# EAGLE design esp32-thing (EAGLE 7.6.0)
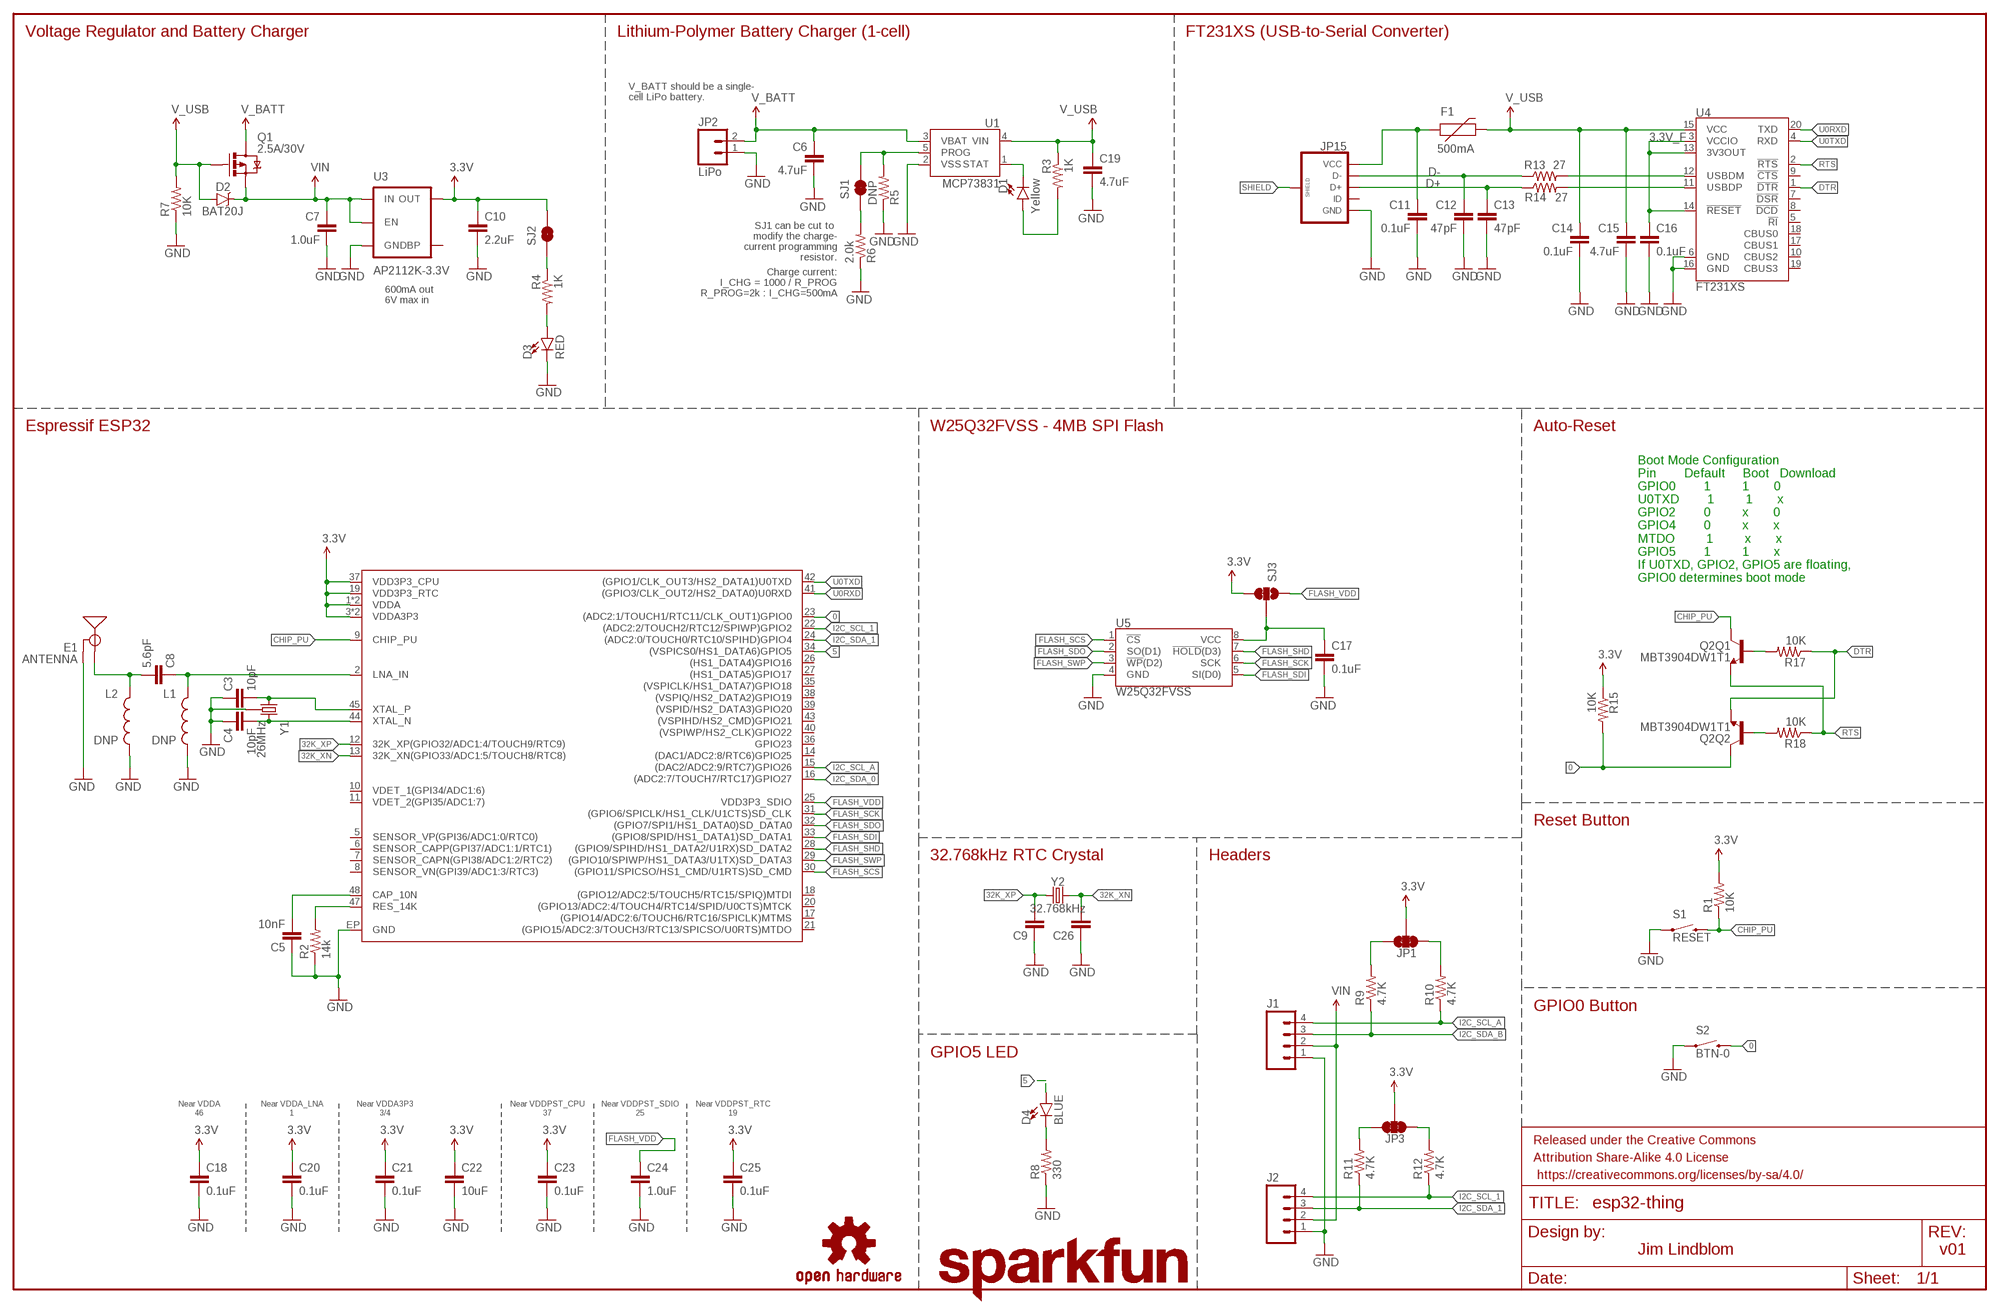
[diagram p0: schematic, sheet 1]

## Parts
C3  10pF  10PF-50V-5%(0603)  [0603-CAP]
C4  10pF  10PF-50V-5%(0603)  [0603-CAP]
C5  10nF  10NF/10000PF-50V-10%(0603)  [0603-CAP]
C6  4.7uF  4.7UF-6.3V-10%(0603)0603  [0603-CAP]
C7  1.0uF  1.0UF-25V-+80/-20(0805)"  [0805-CAP]
C8  5.6pF  CAP0603-CAP  [0603-CAP]
C9  CAP0603-CAP  [0603-CAP]
C10  2.2uF  2.2UF-10V-20%(0603)  [0603-CAP]
C11  0.1uF  0.1UF-25V(+80/-20%)(0603)  [0603-CAP]
C12  47pF  47PF-50V-5%(0603)  [0603-CAP]
C13  47pF  47PF-50V-5%(0603)  [0603-CAP]
C14  0.1uF  0.1UF-25V(+80/-20%)(0603)  [0603-CAP]
C15  4.7uF  4.7UF-6.3V-10%(0603)0603  [0603-CAP]
C16  0.1uF  0.1UF-25V(+80/-20%)(0603)  [0603-CAP]
C17  0.1uF  0.1UF-25V(+80/-20%)(0603)  [0603-CAP]
C18  0.1uF  0.1UF-25V(+80/-20%)(0603)  [0603-CAP]
C19  4.7uF  4.7UF-6.3V-10%(0603)0603  [0603-CAP]
C20  0.1uF  0.1UF-25V(+80/-20%)(0603)  [0603-CAP]
C21  0.1uF  0.1UF-25V(+80/-20%)(0603)  [0603-CAP]
C22  10uF  10UF-6.3V-20%(0603)  [0603-CAP]
C23  0.1uF  0.1UF-25V(+80/-20%)(0603)  [0603-CAP]
C24  1.0uF  1.0UF-16V-10%(0603)  [0603-CAP]
C25  0.1uF  0.1UF-25V(+80/-20%)(0603)  [0603-CAP]
C26  CAP0603-CAP  [0603-CAP]
D1  Yellow  LED-YELLOW0603  [LED-0603]
D2  BAT20J  DIODE-SCHOTTKY-BAT20J  [SOD-323]
D3  RED  LED-RED0603  [LED-0603]
D4  BLUE  LED-BLUE0603  [LED-0603]
E1  ANTENNA  ANTENNATRACE-TUNED  [TRACE_ANTENNA_2.4GHZ_25.7MM_TUNED]
F1  500mA  PTCSMD  [PTC-1206]
FRAME1  FRAME-LEDGER  [CREATIVE_COMMONS]
J1  M04POLAR_LOCK  [MOLEX-1X4_LOCK]
J2  M04POLAR_LOCK  [MOLEX-1X4_LOCK]
JP1  JUMPER-PAD-3-NC_BY_TRACE  [PAD-JUMPER-3-3OF3_NC_BY_TRACE_YES_SILK_FULL_BOX]
JP2  LiPo  M02JST-PTH-2  [JST-2-PTH]
JP3  JUMPER-PAD-3-NC_BY_TRACE  [PAD-JUMPER-3-3OF3_NC_BY_TRACE_YES_SILK_FULL_BOX]
JP15  USB_MICROB_PLUGCONN-11752  [USB-B-MICRO-SMD_V03]
L1  DNP  INDUCTOR0603  [0603]
L2  DNP  INDUCTOR0603  [0603]
LOGO1  SFE_LOGO_NAME.2_INCH  [SFE_LOGO_NAME_.2]
LOGO2  OSHW-LOGOMINI  [OSHW-LOGO-MINI]
Q1  2.5A/30V  MOSFET-PCHANNELDMG2307L  [SOT23-3]
Q2  MBT3904DW1T1  [SC70-6]
R1  10K  10KOHM-1/10W-1%(0603)0603  [0603-RES]
R2  14k  RESISTOR0603-RES  [0603-RES]
R3  1K  1KOHM-1/10W-1%(0603)  [0603-RES]
R4  1K  1KOHM-1/10W-1%(0603)  [0603-RES]
R5  DNP  RESISTORPTH-1/6W  [1/6W-RES]
R6  2.0k  2.0KOHM1/10W5%(0603)  [0603-RES]
R7  10K  10KOHM1/10W1%(0603)0603  [0603-RES@1]
R8  330  330OHM1/10W1%(0603)  [0603-RES]
R9  4.7K  4.7KOHM-1/10W-1%(0603)  [0603-RES]
R10  4.7K  4.7KOHM-1/10W-1%(0603)  [0603-RES]
R11  4.7K  4.7KOHM-1/10W-1%(0603)  [0603-RES]
R12  4.7K  4.7KOHM-1/10W-1%(0603)  [0603-RES]
R13  27  27OHM1/10W1%(0603)0603-RES  [0603-RES]
R14  27  27OHM1/10W1%(0603)0603-RES  [0603-RES]
R15  10K  10KOHM1/10W1%(0603)0603  [0603-RES@1]
R17  10K  10KOHM1/10W1%(0603)0603  [0603-RES@1]
R18  10K  10KOHM1/10W1%(0603)0603  [0603-RES@1]
S1  RESET  SWITCH-MOMENTARY-2SMD-4.6X2.8MM  [TACTILE_SWITCH_SMD_4.6X2.8MM]
S2  BTN-0  SWITCH-MOMENTARY-2SMD-4.6X2.8MM  [TACTILE_SWITCH_SMD_4.6X2.8MM]
SJ1  JUMPER-PAD-2-NC_BY_TRACE  [PAD-JUMPER-2-NC_BY_TRACE_YES_SILK]
SJ2  JUMPER-PAD-2-NC_BY_TRACE  [PAD-JUMPER-2-NC_BY_TRACE_YES_SILK]
SJ3  JUMPER-PAD-3-2OF3_NC_BY_TRACE_SMALL  [PAD-JUMPER-3-2OF3_NC_BY_TRACE_YES_SILK_FULL_BOX]
U1  MCP73831  [SOT23-5]
U3  AP2112K-3.3V  V_REG_LDOSMD  [SOT23-5]
U4  FT231XS  [SSOP20_L]
U5  W25Q32FVSS  [SOIC-8]
U$1  ESP32  [QFN48-0.4MM]
Y1  26MHz  CRYSTAL-GROUNDED3.2X2.5  [CRYSTAL-SMD-3.2X2.5]
Y2  32.768kHz  CRYSTAL-32.768KHZSMD-3.2X1.5  [CRYSTAL-SMD-3.2X1.5MM]

## Nets
0: Q2.6(Q2:C) R15.2 S2.3 S2.4 U$1.23((ADC2:1/TOUCH1/RTC11/CLK_OUT1)GPIO0)
3.3V: C10.1 C18.1 C20.1 C21.1 C22.1 C23.1 C25.1 JP1.2 JP3.2 R1.2 R15.1 SJ2.2 SJ3.3 U3.5(OUT) U$1.1(VDDA) U$1.3(VDDA3P3) U$1.4(VDDA3P3) U$1.19(VDD3P3_RTC) U$1.37(VDD3P3_CPU) U$1.46(VDDA)
3.3V_F: C16.1 U4.3(VCCIO) U4.13(3V3OUT) U4.14(!RESET)
5: D4.A U$1.34((VSPICS0/HS1_DATA6)GPIO5)
32K_XN: C26.2 U$1.13(32K_XN(GPIO33/ADC1:5/TOUCH8/RTC8)) Y2.P$2
32K_XP: C9.2 U$1.12(32K_XP(GPIO32/ADC1:4/TOUCH9/RTC9)) Y2.P$1
CAP_10N: C5.2 U$1.48(CAP_10N)
CHIP_PU: Q2.3(Q1:C) R1.1 S1.3 S1.4 U$1.9(CHIP_PU)
D+: C13.1 JP15.D+ R14.1
D-: C12.1 JP15.D- R13.1
DTR: Q2.1(Q2:E) R17.1 U4.1(!DTR)
FLASH_SCK: U5.6(SCK) U$1.31((GPIO6/SPICLK/HS1_CLK/U1CTS)SD_CLK)
FLASH_SCS: U5.1(!CS!) U$1.30((GPIO11/SPICSO/HS1_CMD/U1RTS)SD_CMD)
FLASH_SDI: U5.5(SI(D0)) U$1.33((GPIO8/SPID/HS1_DATA1)SD_DATA1)
FLASH_SDO: U5.2(SO(D1)) U$1.32((GPIO7/SPI1/HS1_DATA0)SD_DATA0)
FLASH_SHD: U5.7(!HOLD!(D3)) U$1.28((GPIO9/SPIHD/HS1_DATA2/U1RX)SD_DATA2)
FLASH_SWP: U5.3(!WP!(D2)) U$1.29((GPIO10/SPIWP/HS1_DATA3/U1TX)SD_DATA3)
FLASH_VDD: C24.1 SJ3.1 U$1.25(VDD3P3_SDIO)
GND: C3.1 C4.1 C5.1 C6.2 C7.2 C9.1 C10.2 C11.2 C12.2 C13.2 C14.2 C15.2 C16.2 C17.2 C18.2 C19.2 C20.2 C21.2 C22.2 C23.2 C24.2 C25.2 C26.1 D3.C E1.GND E1.GND2(GND) J1.1 J2.1 JP2.1 JP15.GND L1.2 L2.2 R2.1 R5.1 R6.1 R7.1 R8.1 S1.1 S1.2 S2.1 S2.2 U1.2(VSS) U3.2(GND) U4.6(GND) U4.16(GND) U5.4(GND) U$1.EP(GND) Y1.2(GND) Y1.4(GND)
I2C_SCL_1: J2.4 R12.1 U$1.22((ADC2:2/TOUCH2/RTC12/SPIWP)GPIO2)
I2C_SCL_A: J1.4 R10.1 U$1.15((DAC2/ADC2:9/RTC7)GPIO26)
I2C_SDA_0: U$1.16((ADC2:7/TOUCH7/RTC17)GPIO27)
I2C_SDA_1: J2.3 R11.1 U$1.24((ADC2:0/TOUCH0/RTC10/SPIHD)GPIO4)
I2C_SDA_B: J1.3 R9.1
LNA_IN: C8.1 L1.1 U$1.2(LNA_IN)
N$1: D4.C R8.2
N$2: D3.A R4.2
N$3: R4.1 SJ2.1
N$4: JP3.3 R11.2
N$5: JP3.1 R12.2
N$6: JP1.3 R9.2
N$7: R13.2 U4.12(USBDM)
N$8: R14.2 U4.11(USBDP)
N$9: D1.C U1.1(STAT)
N$10: Q2.5(Q1:B) R17.2
N$11: JP1.1 R10.2
N$12: Q2.2(Q2:B) R18.2
N$14: R5.2 SJ1.2 U1.5(PROG)
N$16: R6.2 SJ1.1
N$17: D1.A R3.2
RES_14K: R2.2 U$1.47(RES_14K)
RTS: Q2.4(Q1:E) R18.1 U4.2(!RTS)
SHIELD: JP15.SHIELD1(SHIELD) JP15.SHIELD2(SHIELD) JP15.SHIELD3(SHIELD)
TRACE_ANT: C8.2 E1.ANT(SIGNAL) L2.1
U0RXD: U4.20(TXD) U$1.41((GPIO3/CLK_OUT2/HS2_DATA0)U0RXD)
U0TXD: U4.4(RXD) U$1.42((GPIO1/CLK_OUT3/HS2_DATA1)U0TXD)
V_BATT: C6.1 JP2.2 Q1.3(D) U1.3(VBAT)
V_USB: C14.1 C15.1 C19.1 D2.A F1.2 Q1.1(G) R3.1 R7.2 U1.4(VIN) U4.15(VCC)
VCC_FLASH: C17.1 SJ3.2 U5.8(VCC)
VIN: C7.1 D2.C J1.2 J2.2 Q1.2(S) U3.1(IN) U3.3(EN)
VUSB: C11.1 F1.1 JP15.VBUS(VCC)
XTAL_N_: C4.2 U$1.44(XTAL_N) Y1.3
XTAL_P_: C3.2 U$1.45(XTAL_P) Y1.1
Unconnected: JP15.ID U3.4(BP) U4.5(!RI) U4.7(!DSR) U4.8(!DCD) U4.9(!CTS) U4.10(CBUS2) U4.17(CBUS1) U4.18(CBUS0) U4.19(CBUS3) U$1.5(SENSOR_VP(GPI36/ADC1:0/RTC0)) U$1.6(SENSOR_CAPP(GPI37/ADC1:1/RTC1)) U$1.7(SENSOR_CAPN(GPI38/ADC1:2/RTC2)) U$1.8(SENSOR_VN(GPI39/ADC1:3/RTC3)) U$1.10(VDET_1(GPI34/ADC1:6)) U$1.11(VDET_2(GPI35/ADC1:7)) U$1.14((DAC1/ADC2:8/RTC6)GPIO25) U$1.17((GPIO14/ADC2:6/TOUCH6/RTC16/SPICLK)MTMS) U$1.18((GPIO12/ADC2:5/TOUCH5/RTC15/SPIQ)MTDI) U$1.20((GPIO13/ADC2:4/TOUCH4/RTC14/SPID/U0CTS)MTCK) U$1.21((GPIO15/ADC2:3/TOUCH3/RTC13/SPICSO/U0RTS)MTDO) U$1.26((HS1_DATA4)GPIO16) U$1.27((HS1_DATA5)GPIO17) U$1.35((VSPICLK/HS1_DATA7)GPIO18) U$1.36(GPIO23) U$1.38((VSPIQ/HS2_DATA2)GPIO19) U$1.39((VSPID/HS2_DATA3)GPIO20) U$1.40((VSPIWP/HS2_CLK)GPIO22) U$1.43((VSPIHD/HS2_CMD)GPIO21)

## Notes on the sheet
- Voltage Regulator and Battery Charger | Lithium-Polymer Battery Charger (1-cell) | FT231XS (USB-to-Serial Converter)
- V_BATT should be a single-
  cell LiPo battery.
- SJ1 can be cut to 
  modify the charge-
  current programming
  resistor.
- Charge current:
  I_CHG = 1000 / R_PROG
  R_PROG=2k : I_CHG=500mA
- 600mA out
  6V max in
- Espressif ESP32 | W25Q32FVSS - 4MB SPI Flash | Auto-Reset
- Boot Mode Configuration
  Pin        Default     Boot   Download
  GPIO0        1         1       0
  U0TXD        1         1       x
  GPIO2        0         x       0
  GPIO4        0         x       x
  MTDO         1         x       x
  GPIO5        1         1       x
  If U0TXD, GPIO2, GPIO5 are floating, 
  GPIO0 determines boot mode
- Reset Button
- 32.768kHz RTC Crystal | Headers
- GPIO0 Button
- GPIO5 LED
- Near VDDA
  46
- Near VDDA_LNA
  1
- Near VDDA3P3
  3/4
- Near VDDPST_CPU
  37
- Near VDDPST_SDIO
  25
- Near VDDPST_RTC
  19
- Jim Lindblom | v01

## Library data of the parts
C3 C4 = SparkFun-Capacitors:10PF-50V-5%(0603): CAP-11812; PROD_ID: CAP-11812
C5 = SparkFun-Capacitors:10NF/10000PF-50V-10%(0603): CAP-00867; PROD_ID: CAP-00867
C6 C15 C19 = SparkFun-Capacitors:4.7UF-6.3V-10%(0603): CAP-08280; PROD_ID: CAP-08280
C7 = SparkFun-Capacitors:1.0UF-25V-+80/-20(0805): CAP-11625; PROD_ID: CAP-11625
C8 = SparkFun-Capacitors:CAP: Capacitor Standard 0603 ceramic capacitor, and 0.1" leaded capacitor.; PROD_ID: CAP-12456
C9 C26 = SparkFun-Passives:CAP: Capacitor Standard 0603 ceramic capacitor, and 0.1" leaded capacitor.
C10 = SparkFun-Capacitors:2.2UF-10V-20%(0603): CAP-07888; PROD_ID: CAP-07888
C11 C14 C16-C18 C20 C21 C23 C25 = SparkFun-Capacitors:0.1UF-25V(+80/-20%)(0603): CAP-00810 Ceramic Standard decoupling cap; PROD_ID: CAP-00810
C12 C13 = SparkFun-Capacitors:47PF-50V-5%(0603): CAP-08913; PROD_ID: CAP-08913
C22 = SparkFun-Capacitors:10UF-6.3V-20%(0603): CAP-11015; PROD_ID: CAP-11015
C24 = SparkFun-Capacitors:1.0UF-16V-10%(0603): CAP-00868; PROD_ID: CAP-00868
D1 = SparkFun-LED:LED-YELLOW: Yellow SMD LEDs LilyPad 1206- DIO-09909 0603- DIO-09003 "SMART" means more efficient and expensive; PROD_ID: DIO-09003
D2 = SparkFun-DiscreteSemi:DIODE-SCHOTTKY: Schottky diodes in SFE's production catalog BAT20J 1A 23V 0.62Vf RB751 120mA 40V 0.37Vf PMEG4005EJ 0.5A 40V 0.42Vf MBRA140 1A 40V 0.5Vf B340A 3A 40V SMA; PROD_ID: DIO-11623
D3 = SparkFun-LED:LED-RED: Red SMD LED Used in manufacturing of most products at SparkFun 0603 - SMD 0603 package Forward Voltage: 1.9V Forward Current: 20mA Datasheet: [Product Link] <http://docs.avagotech.com/docs/AV02-0551EN> 0603 SMART - SMD 0603 SMART package ( more efficient and expensive) Forward Voltage: 1.8V Forward Current: 20mA Datasheet: [Product Link] <http://www.osram-os.com/Graphics/XPic2/00077099_0.pdf> 1206 - SMD 1206 package Forward Voltage: 2V Forward Current: 20mA Datasheet: [Product Link] <https://www.sparkfun.com/datasheets/DevTools/LilyPad/Q150OVS4.pdff> 1206 LilyPad - SMD 1206 LilyPad package Forward Voltage: 2V Forward Current: 20mA Datasheet: [Product Link] <https://www.sparkfun.com/datasheets/DevTools/LilyPad/Q150OVS4.pdf>; PROD_ID: DIO-00819
D4 = SparkFun-LED:LED-BLUE: Blue SMD LED Used in manufacturing of various products at SparkFun 0603 - SMD 0603 package Manufacturer: Rohm Semiconductor Forward Voltage: 2.9V Forward Current: 5mA Wavelength: 470nm Digikey: [Product Link] <http://www.digikey.com/product-detail/en/SMLE12BC7TT86/511-1589-2-ND/1641808> 1206 - SMD1206 package Manufacturer:Lite-On Inc. Forward Voltage: 3.3V Forward Current: 20mA Wavelength: 468nm Digikey: [Product Link] <http://www.digikey.com/product-detail/en/lite-on-inc/LTST-C150TBKT/160-1643-1-ND/573584>; PROD_ID: DIO-08575
E1 = esp32-thing-temp:ANTENNA: Chip antenna Chip antenna with ground or secondary connection. Common with larger metal RF connectors.
F1 = SparkFun-PowerIC:PTC: Resettable Fuse PTC Resettable Fuse. Spark Fun Electronics SKU : COM-08357; PROD_ID: RES-11150
FRAME1 = SparkFun-Aesthetics:FRAME-LEDGER: Schematic Frame Standard 11x14 US Ledger frame
J1 J2 = SparkFun-Connectors:M04: Header 4 Standard 4-pin 0.1" header. Use with straight break away headers (SKU : PRT-00116), right angle break away headers (PRT-00553), swiss pins (PRT-00743), machine pins (PRT-00117), and female headers (PRT-00115). Molex polarized connector foot print use with SKU : PRT-08231 with associated crimp pins and housings. 1MM SMD Version SKU: PRT-10208
JP1 JP3 = SparkFun-Passives:JUMPER-PAD-3-NC_BY_TRACE
JP2 = SparkFun-Connectors:M02: Standard 2-pin 0.1" header. Use with - straight break away headers ( PRT-00116) - right angle break away headers (PRT-00553) - swiss pins (PRT-00743) - machine pins (PRT-00117) - female headers (PRT-00115) Molex polarized connector foot print use with: PRT-08233 with associated crimp pins and housings. 2.54_SCREWTERM for use with PRT-10571. 3.5mm Screw Terminal footprints for PRT-08084 5mm Screw Terminal footprints for use with PRT-08432; PROD_ID: CONN-09863; SKU: PRT-09914
JP15 = SparkFun-Connectors:USB_MICROB_PLUG: USB Micro-B connectors Some male, some female. Watch your step!; PROD_ID: CONN-11752
L1 L2 = SparkFun-Passives:INDUCTOR: Inductors Basic Inductor/Choke - 0603 and 1206. Footprints are not proven and vary greatly between part numbers. INDUCTOR POWER 3.3UH 4.0A SMD 0.197" L x 0.197" W x 0.177" H (5.00mm x 5.00mm x 4.50mm)
LOGO1 = SparkFun-Aesthetics:SFE_LOGO_NAME: SFE Logo, name only This is the SparkFun name logo. The logo on the schematic will always be the same size; the package variant is the height of the flame part of the logo (or the height the flame would be, if it were drawn). Default layer for the logo on the board is tSilk.
LOGO2 = SparkFun-Aesthetics:OSHW-LOGO: Open Source Hardware Logo This logo indicates the piece of hardware it is found on incorporates a OSHW license and/or adheres to the definition of open source hardware found here: http://freedomdefined.org/OSHW
Q1 = SparkFun-DiscreteSemi:MOSFET-PCHANNEL: Generic PMOSFET IRLML2244 - TRANS-11153 (SOT-23 -20V -4.3A) (1.Gate 2.Source 3.Drain) FQP27P06 - COM-10349 <http://www.sparkfun.com/products/10349> (TO-220 -60V -27A) (1.Gate 2.Source 3.Drain); PROD_ID: TRANS-11308
Q2 = esp32-thing-temp:MBT3904DW1T1: MBT3904DW1 Dual NPN Transistors The MBT3904W1 puts two general purpose 3904 NPN transistors in a single package. Datasheet <http://www.onsemi.com/pub_link/Collateral/MBT3904DW1T1-D.PDF>; PROD_ID: TRANS-13337
R1 = SparkFun-Resistors:10KOHM-1/10W-1%(0603): RES-00824; PROD_ID: RES-00824
R2 R5 = SparkFun-Passives:RESISTOR: Resistor Basic schematic elements and footprints for 0603, 1206, and PTH resistors.
R3 R4 = SparkFun-Resistors:1KOHM-1/10W-1%(0603): RES-07856; PROD_ID: RES-07856
R6 = SparkFun-Resistors:2.0KOHM1/10W5%(0603): RES-08296; PROD_ID: RES-08296
R7 R15 R17 R18 = SparkFun-Resistors:10KOHM1/10W1%(0603): RES-00824; PROD_ID: RES-00824
R8 = SparkFun-Resistors:330OHM1/10W1%(0603): RES-00818; PROD_ID: RES-00818
R9-R12 = SparkFun-Resistors:4.7KOHM-1/10W-1%(0603): RES-07857; PROD_ID: RES-07857
R13 R14 = SparkFun-Resistors:27OHM1/10W1%(0603): RES-09334; PROD_ID: RES-09334
S1 S2 = SparkFun-Electromechanical:SWITCH-MOMENTARY-2: Various NO switches- pushbuttons, reed, etc; PROD_ID: SWCH-13065
SJ1 SJ2 = SparkFun-Passives:JUMPER-PAD-2-NC_BY_TRACE
SJ3 = SparkFun-Passives:JUMPER-PAD-3-2OF3_NC_BY_TRACE
U1 = SparkFun-PowerIC:MCP73831: Miniature single cell, fully integrated Li-Ion, Li-polymer charge management controller http://ww1.microchip.com/downloads/en/DeviceDoc/20001984g.pdf IC-09995; PROD_ID: IC-09995
U3 = SparkFun-PowerIC:V_REG_LDO: Voltage Regulator LDO Standard 150mA LDO voltage regulator in SOT-23 layout. Micrel part MIC5205. BP (by-pass) pin is used to lower output noise with 470pF cap.; PROD_ID: VREG-12457
U4 = SparkFun-DigitalIC:FT231X: FTDI FT231X Full Speed USB to Full-handshake UART This USB2.0 Full Speed IC offers a compact bridge to full handshake UART interfaces. The device is a UART, capable of operating up to 3MBaud, with low power consumption (8mA). The FT231X includes the complete FT-X series feature set and enables USB to be added into a system design quickly and easily over a UART interface.; PROD_ID: IC-11524
U5 = SparkFun-DigitalIC:W25Q32FV: Winbond W25Q32FV 32Mbit (4MB) Flash The W25Q32FV support the standard Serial Peripheral Interface (SPI), Dual/Quad I/O SPI as well as 2-clocks instruction cycle Quad Peripheral Interface (QPI). Datasheet <http://www.winbond.com/resource-files/w25q32fv%20revh%20091613.pdf>; PROD_ID: IC-13229
U$1 = esp32-thing-temp:ESP32; PROD_ID: IC-13338
Y1 = things:CRYSTAL-GROUNDED; PROD_ID: XTAL-12454
Y2 = SparkFun-Clocks:CRYSTAL-32.768KHZ: 32.768kHz Crystal Frequency: 32.768kHz Frequency Stability: ±20ppm Load Capacitance: 12.5pF (PTH-2X6 & SMD-3.2X1.5), 6pF (SMD-2X6); PROD_ID: XTAL-13062

## Board
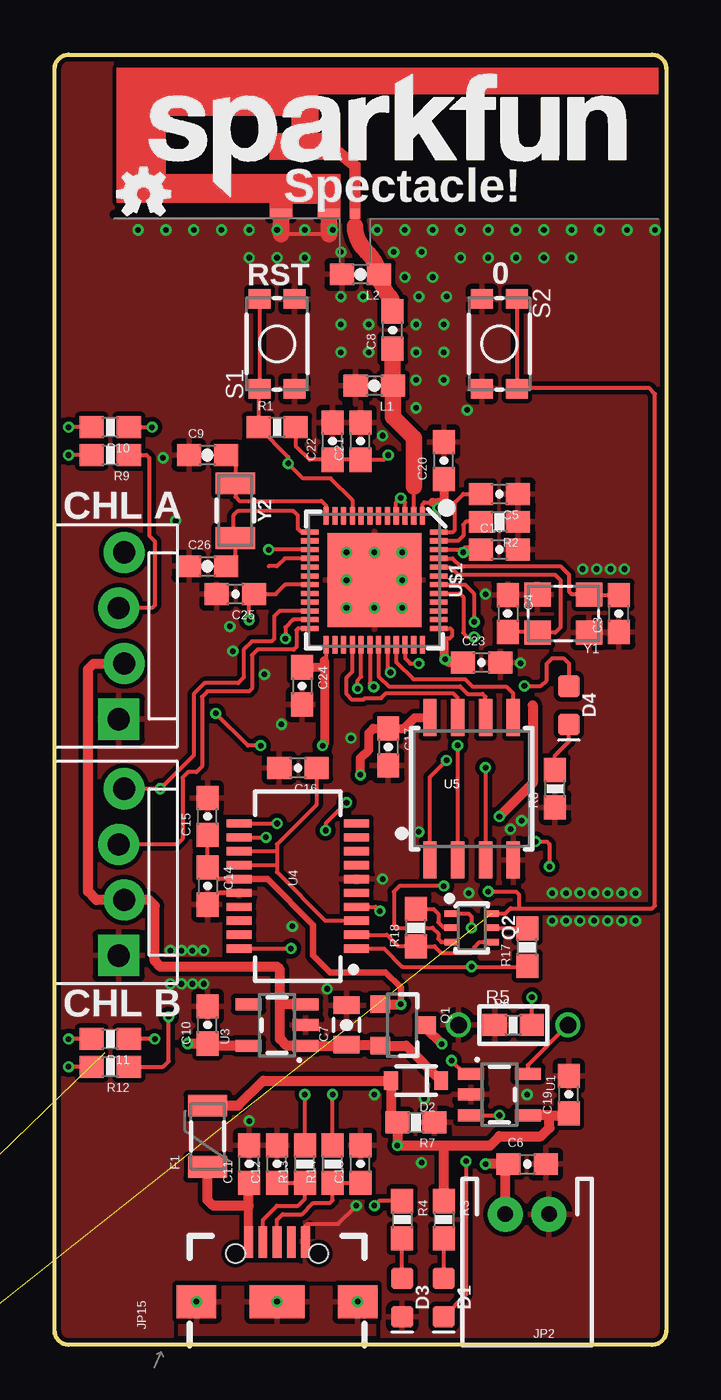
[diagram p1: board, top side]
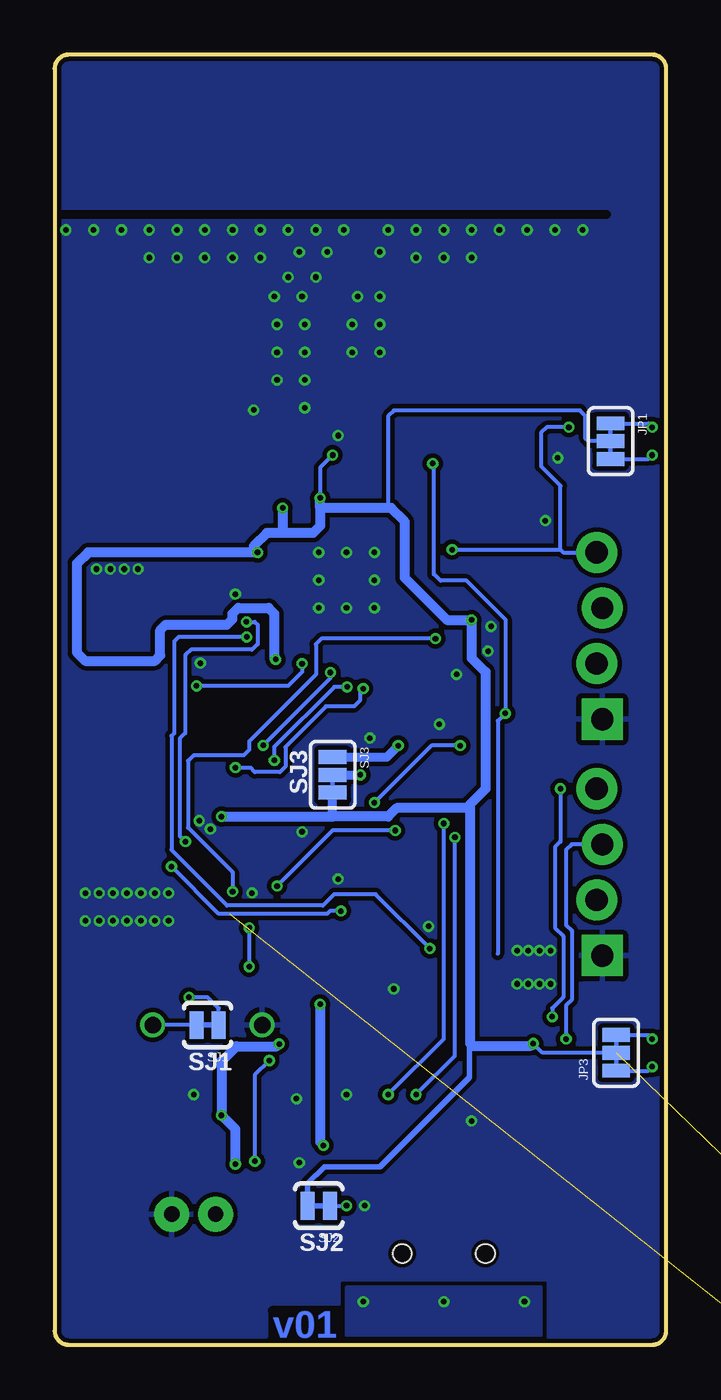
[diagram p2: board, bottom side, seen from below]

Size 27.94 x 58.93 mm. Coordinates in mm from the lower left corner, seen from the top.
Outline: 0.64,58.93 27.3,58.93 arc-90 27.94,58.29 27.94,0.64 arc-90 27.3,0 0.64,0 arc-90 0,0.64 0,58.29 arc-90 0.64,58.93
Copper layers (1*16): Top 0.035mm / dielectric 1.5mm / Bottom 0.035mm
Design rules "SparkFun-2-layer-FAB-LIMIT *": minimum track width 6mil, minimum drill 6mil, track to track 6mil, track to pad 6mil, pad to pad 6mil, via to via 6mil, smd to smd 6mil, copper to edge 4mil, drill to drill 4mil, minimum pad ring 5mil, minimum via ring 5mil, stop-mask expansion 4mil, vias tented up to drill 25mil, thermal gap 10mil

### Footprints (pad centres in the part's own frame; a part is rotated, then mirrored left to right if it is on the bottom)
0603-CAP = smd 1.1 x 1: 1 -0.85,0; 2 0.85,0
0805-CAP = smd 0.8 x 1.2: 1 -0.9,0; 2 0.9,0
LED-0603 = smd 1 x 1: A 0,-0.877; C 0,0.877
SOD-323 = smd 0.63 x 0.83: A 1.15,0; C -1.15,0
TRACE_ANTENNA_2.4GHZ_25.7MM_TUNED = smd 0.46 x 0.46: ANT 0,0.23 | smd 1 x 0.46: GND -1.18,0.23; GND2 -3.38,0.23
PTC-1206 = smd 1 x 1.8: 1 -1.4,0; 2 1.4,0
MOLEX-1X4_LOCK = drill 1.016 pad 1.88 square: 1 0,0.127 | drill 1.016 pad 1.88: 2 2.54,-0.127; 3 5.08,0.127; 4 7.62,-0.127
PAD-JUMPER-3-3OF3_NC_BY_TRACE_YES_SILK_FULL_BOX = smd 0.635 x 1.27: 1 -0.813,0; 2 0,0; 3 0.813,0
JST-2-PTH = drill 0.7 pad 1.6: 1 -1,0; 2 1,0
USB-B-MICRO-SMD_V03 = smd 1.45 x 0.4: D+ 2.725,0; D- 2.725,0.65; GND 2.725,-1.3; ID 2.725,-0.65; VBUS 2.725,1.3 | smd 1.5 x 1.8: SHIELD1 0,3.685; SHIELD2 0,-3.685 | smd 1.5 x 2.5: SHIELD3 0,0 | hole 0.85: 2.2,1.9; 2.2,-1.9
0603 = smd 1.1 x 1: 1 -0.85,0; 2 0.85,0
SOT23-3 = smd 0.8 x 0.9: 1 -0.95,-1; 2 0.95,-1; 3 0,1.1
SC70-6 = smd 0.3 x 0.66: 1 -0.65,-0.92; 2 0,-0.92; 3 0.65,-0.92; 4 0.65,0.92; 5 0,0.92; 6 -0.65,0.92
0603-RES = smd 1.1 x 1: 1 -0.85,0; 2 0.85,0
1/6W-RES = drill 0.762: 1 -2.5,0; 2 2.5,0
0603-RES@1 = smd 1.1 x 1: 1 -0.85,0; 2 0.85,0
TACTILE_SWITCH_SMD_4.6X2.8MM = smd 0.9 x 1: 1 -2.05,-0.8; 2 2.05,-0.8; 3 2.05,0.8; 4 -2.05,0.8
PAD-JUMPER-2-NC_BY_TRACE_YES_SILK = smd 0.635 x 1.27: 1 -0.508,0; 2 0.508,0
PAD-JUMPER-3-2OF3_NC_BY_TRACE_YES_SILK_FULL_BOX = smd 0.635 x 1.27: 1 -0.813,0; 2 0,0; 3 0.813,0
SOT23-5 = smd 0.55 x 1.2: 1 -0.95,-1.3; 2 0,-1.3; 3 0.95,-1.3; 4 0.95,1.3; 5 -0.95,1.3
SSOP20_L = smd 0.381 x 1.143: 1 -2.857,-2.68; 2 -2.223,-2.68; 3 -1.587,-2.68; 4 -0.953,-2.68; 5 -0.318,-2.68; 6 0.318,-2.68; 7 0.953,-2.68; 8 1.587,-2.68; 9 2.223,-2.68; 10 2.857,-2.68; 11 2.857,2.68; 12 2.223,2.68; 13 1.587,2.68; 14 0.953,2.68; 15 0.318,2.68; 16 -0.318,2.68; 17 -0.953,2.68; 18 -1.587,2.68; 19 -2.223,2.68; 20 -2.857,2.68
SOIC-8 = smd 0.61 x 1.702: 1 -1.905,-3.251; 2 -0.635,-3.251; 3 0.635,-3.251; 4 1.905,-3.251; 5 1.905,3.251; 6 0.635,3.251; 7 -0.635,3.251; 8 -1.905,3.251
QFN48-0.4MM = smd 0.8 x 0.23: 1 -2.95,2.2; 2 -2.95,1.8; 3 -2.95,1.4; 4 -2.95,1; 5 -2.95,0.6; 6 -2.95,0.2; 7 -2.95,-0.2; 8 -2.95,-0.6; 9 -2.95,-1; 10 -2.95,-1.4; 11 -2.95,-1.8; 12 -2.95,-2.2; 25 2.95,-2.2; 26 2.95,-1.8; 27 2.95,-1.4; 28 2.95,-1; 29 2.95,-0.6; 30 2.95,-0.2; 31 2.95,0.2; 32 2.95,0.6; 33 2.95,1; 34 2.95,1.4; 35 2.95,1.8; 36 2.95,2.2 | smd 0.23 x 0.8: 13 -2.2,-2.95; 14 -1.8,-2.95; 15 -1.4,-2.95; 16 -1,-2.95; 17 -0.6,-2.95; 18 -0.2,-2.95; 19 0.2,-2.95; 20 0.6,-2.95; 21 1,-2.95; 22 1.4,-2.95; 23 1.8,-2.95; 24 2.2,-2.95; 37 2.2,2.95; 38 1.8,2.95; 39 1.4,2.95; 40 1,2.95; 41 0.6,2.95; 42 0.2,2.95; 43 -0.2,2.95; 44 -0.6,2.95; 45 -1,2.95; 46 -1.4,2.95; 47 -1.8,2.95; 48 -2.2,2.95 | smd 4.3 x 4.3: EP 0,0
CRYSTAL-SMD-3.2X2.5 = smd 1.2 x 1.1: 1 -1.175,-0.875; 2 1.175,-0.875; 3 1.175,0.875; 4 -1.175,0.875
CRYSTAL-SMD-3.2X1.5MM = smd 1 x 1.8: P$1 -1.25,0; P$2 1.25,0

### Placement (x,y rotation side)
C3  25.78,33.4 90 top
C4  20.7,33.4 270 top
C5  20.32,38.86 180 top
C6  21.59,8.26 0 top
C7  13.34,14.61 90 top
C8  15.44,46.35 90 top
C9  6.99,40.64 0 top
C10  6.99,14.61 90 top
C11  8.89,8.26 90 top
C12  10.16,8.26 90 top
C13  13.97,8.26 90 top
C14  6.99,20.95 270 top
C15  6.99,24.13 90 top
C16  11.11,26.35 180 top
C17  15.24,27.3 270 top
C18  20.32,36.32 0 top
C19  23.49,11.43 90 top
C20  17.78,40.39 90 top
C21  13.97,41.27 90 top
C22  12.7,41.27 90 top
C23  19.51,31.17 0 top
C24  11.3,30.1 270 top
C25  8.25,34.29 180 top
C26  6.99,35.56 0 top
D1  17.78,2.16 180 top
D2  16.51,12.06 180 top
D3  15.88,2.16 180 top
D4  23.49,29.21 180 top
E1  13.72,51.44 0 top
F1  6.99,9.53 90 top
FRAME1  -14.61,-19.05 0 top  (outside the outline)
J1  3.05,28.57 90 top
J2  3.05,17.78 90 top
JP1  2.54,41.27 270 bottom
JP2  21.59,5.97 180 top
JP3  2.29,13.34 90 bottom
JP15  10.16,1.97 90 top
L1  14.61,43.81 180 top
L2  13.97,48.9 180 top
LOGO1  4.32,52.45 0 top
LOGO2  4.06,52.58 0 top
Q1  15.88,14.61 270 top
Q2  19.05,19.05 270 top
R1  10.16,41.91 0 top
R2  20.32,37.59 180 top
R3  17.78,5.71 270 top
R4  15.88,5.71 270 top
R5  20.95,14.61 0 top
R6  20.95,14.61 0 top
R7  16.51,10.16 180 top
R8  22.86,25.4 90 top
R9  2.54,40.64 180 top
R10  2.54,41.91 180 top
R11  2.54,13.97 180 top
R12  2.54,12.7 180 top
R13  11.43,8.26 90 top
R14  12.7,8.26 90 top
R15  -33.02,-21.59 0 top  (outside the outline)
R17  21.59,18.16 90 top
R18  16.51,19.05 90 top
S1  10.16,45.72 90 top
S2  20.32,45.72 270 top
SJ1  20.95,14.61 180 bottom
SJ2  15.88,6.35 180 bottom
SJ3  15.24,26.04 270 bottom
U1  20.32,11.43 270 top
U3  10.16,14.61 90 top
U4  11.11,20.95 90 top
U5  19.05,25.4 0 top
U$1  14.61,34.92 270 top
Y1  23.24,33.4 180 top
Y2  8.25,38.1 270 top

### Tracks (layer width: path | path; a pad name or v marks a point on that pad's centre or on a via)
0  (via drill 0.25)  (1 unrouted)
  Top 0.178: S2.4 S2.3 21.14,43.69 27.18,43.69 27.43,43.43 27.43,20.07 27.3,19.94 21.21,19.94 | Q2.6 20.59,19.7 20.83,19.94 21.21,19.94 | U$1.23 10.9,33.12 10.54,32.77 v10.54,32.26 | v19.81,20.7 21.08,20.7 21.21,20.57 21.21,19.94
  Bottom 0.178: v10.54,32.26 15.75,32.26 16,32 16,30.61 19.05,27.56 19.05,27.18 19.3,26.92 21.59,26.92 21.84,26.67 21.84,23.62 19.81,21.59 v19.81,20.7
3.3V  (via drill 0.25)  (1 unrouted)
  Top 0.152: 18.54,36.33 v18.67,36.2
  Top 0.178: 7.08,13.65 C10.1 | v6.07,13.76 6.07,13.69 | 21.86,29.22 21.84,29.21 | v15.24,40.64 15.02,40.42 C21.1 C22.1 11.64,40.42 11.01,41.06 R1.2 | v8.89,33.11 8.89,34.08 C25.1 10.1,34.29 10.53,34.73 U$1.19 | 17.27,38.48 16.89,38.48 16.8,38.4 U$1.1 | U$1.46 18.54,36.33 | U$1.4 15.61,38.48 v15.81,38.68 16,38.49 U$1.3 | U$1.37 18.07,32.73 18.16,32.64 18.16,32.38 18.03,32.26 17.91,32.26 17.78,32.13
  Top 0.406: C20.1 17.78,38.48 17.53,38.48 | 17.27,38.48 17.53,38.48 | v17.53,38.23 17.53,38.48 | v18.67,36.2 18.8,36.32 C18.1 | 17.78,32.13 17.78,31.37 v17.84,31.3 17.98,31.17 C23.1
  Top 0.457: 21.84,29.21 21.84,25.65 v20.32,24.13 | U3.5 7.08,13.65 | C10.1 v6.07,13.76
  Bottom 0.178: 8.95,24.51 8.95,24.7 | v15.24,40.64 15.81,40.07 v15.81,38.68 | JP1.2 3.56,41.27 3.68,41.4 3.68,42.42 3.94,42.67 12.45,42.67 12.7,42.42 12.7,38.35 12.83,38.23 | JP3.2 5.65,13.34 v6.07,13.76
  Bottom 0.254: SJ2.2 16.38,7.37 15.62,8.13 13.08,8.13 8.99,12.22 8.99,13.53 U3.5
  Bottom 0.406: 15.24,24.13 SJ3.3 | 18.85,36.47 18.82,36.47 | v18.67,36.2 18.85,36.2
  Bottom 0.457: 15.81,38.23 12.83,38.23 12.57,38.23 11.94,37.59 11.94,35.03 10.02,33.11 v8.89,33.11 8.89,31.37 8.25,30.73 8.25,25.4 8.95,24.7 | 15.81,38.23 v15.81,38.68 | 15.81,38.23 15.81,37.4 16.13,37.08 17.53,37.08 | v17.53,38.23 17.53,37.08 | 18.85,36.2 18.85,36.47 18.24,37.08 17.53,37.08 | v20.32,24.13 15.24,24.13 12.7,24.13 12.32,24.51 8.95,24.51 8.95,13.75 U3.5 6.17,13.65 v6.07,13.76 | v18.67,36.2 26.42,36.2 26.92,35.69 26.92,31.62 26.54,31.24 23.37,31.24 23.11,31.5 23.11,32.64 22.86,32.89 20.07,32.89 19.81,33.15 19.81,33.4 19.56,33.66 18.16,33.66 17.91,33.4 17.91,31.37 v17.84,31.3
3.3V_F
  Top 0.178: U4.3 12.38,19.37 10.16,21.59 10.16,21.91 | U4.14 10.16,21.91 | 10.16,22.54 U4.13 | C16.1 11.96,24.66 10.16,22.86 10.16,22.54 | 10.16,22.54 10.16,21.91
5  (via drill 0.25)
  Top 0.178: U$1.34 16,31.37 16.26,31.11 v16.64,31.11 | v21.46,30.1 22.22,30.1 22.48,30.35 22.48,31.11 22.73,31.37 23.24,31.37 23.49,31.11 D4.A
  Bottom 0.178: v16.64,31.11 16.64,30.73 17.27,30.1 v21.46,30.1
32K_XN
  Top 0.178: 8.72,36.85 Y2.P$2 | Y2.P$2 8.18,36.85 8.18,37.9 8.38,38.1 10.9,38.1 11.11,37.88 11.11,37.27 11.26,37.12 U$1.13 | C26.2 8.25,35.98 Y2.P$2
32K_XP
  Top 0.178: C9.2 8.25,40.22 Y2.P$1 8.25,38.73 8.45,38.54 12.19,38.54 12.41,38.33 U$1.12
CAP_10N
  Top 0.178: C5.2 18.67,38.86 18.29,38.48 18.29,37.21 18.2,37.12 U$1.48
CHIP_PU  (via drill 0.25)
  Top 0.178: S1.3 S1.4 9.31,43.62 R1.1 10.67,40.55 v10.67,40.26 11.35,39.57 12.61,39.57 13.61,38.58 U$1.9 | v13.34,24.77 12.38,23.81 v12.38,23.5 | v9.41,27.37 8.83,27.37 v7.35,28.84 | v17.78,20.95 15.75,20.95 15.49,20.7 15.49,19.18 15.62,19.05 17.27,19.05 17.53,18.8 17.53,18.54 17.67,18.4 Q2.3
  Bottom 0.178: v12.38,23.5 15.24,23.5 v17.78,20.95 | v9.41,27.37 10.73,27.37 v13.34,24.77 | v10.67,40.26 10.62,40.21 10.62,35.2 10.31,34.9 9.12,34.9 7.35,33.13 v7.35,28.84 7.7,28.5 7.7,17.86
D+
  Top 0.178: JP15.D+ 10.16,5.71 10.41,5.97 11.3,5.97 11.81,6.48 12.57,6.48 12.7,6.6 R14.1 C13.1
D-
  Top 0.178: JP15.D- 9.51,5.7 10.16,6.35 11.11,6.35 11.43,6.67 R13.1 C12.1
DTR  (via drill 0.25)
  Top 0.178: U4.1 15.05,18.1 15.88,17.27 v19.05,17.27 21.55,17.27 R17.1 | Q2.1 18.91,19.7 19.05,19.56 v19.05,19.05
  Bottom 0.178: v19.05,19.05 v19.05,17.27
FLASH_SCK
  Top 0.178: U5.6 19.68,29.59 19.54,29.73 18.86,29.73 18.52,30.07 15.27,30.07 14.8,30.53 U$1.31
FLASH_SCS  (via drill 0.25)
  Top 0.178: U5.1 17.14,25.93 v17.91,26.7 | U$1.30 14.41,30.22 v14.58,30.05
  Bottom 0.178: v17.91,26.7 17.91,27.3 15.16,30.05 v14.58,30.05
FLASH_SDI
  Top 0.178: U5.5 20.95,29.74 20.64,30.06 19.09,30.06 18.74,30.4 16.38,30.4 15.61,31.18 U$1.33
FLASH_SDO  (via drill 0.25)
  Top 0.178: U5.2 v18.41,27.38 | U$1.32 15.2,30.84 v15.34,30.71
  Bottom 0.178: v15.34,30.71 15.34,30.45 v18.41,27.38
FLASH_SHD
  Top 0.178: U5.7 18.41,29.55 18.22,29.74 15.11,29.74 14.91,29.54 14.17,29.54 14.1,29.46 13.59,29.46 13.34,29.72 13.34,30.48 13.61,30.75 U$1.28
FLASH_SWP  (via drill 0.25)
  Top 0.178: v19.68,26.36 U5.3 | v13.84,29.97 13.84,30.35 14,30.52 U$1.29
  Bottom 0.178: v19.68,26.36 19,26.36 18.8,26.16 17.65,26.16 17.4,26.42 17.4,27.3 15.55,29.16 14.27,29.16 13.97,29.46 13.97,29.84 v13.84,29.97
FLASH_VDD  (via drill 0.25)
  Top 0.178: U$1.25 12.41,31.33
  Top 0.203: 12.41,31.33 12.32,31.24
  Top 0.406: 12.32,31.24 12.32,30.86 | 12.32,30.86 12.32,27.45 v12.24,27.37 | C24.1 12.23,30.95 12.32,30.86
  Bottom 0.406: SJ3.1 12.76,26.85 v12.24,27.37
GND  (via drill 0.25)
  Top 0.178: U4.16 7.52,20.64 C14.2 | 12.54,50.72 10.34,50.72 | JP15.GND 11.46,5.43 11.56,5.52 12.95,5.52 v13.78,6.35
  Top 0.762: E1.GND 12.54,50.72 | 10.34,50.72 E1.GND2
  other vias: 14.61,11.43 8.89,10.22 16.89,11.24 16.76,8.32 21.59,11.43 12.45,16.26 14.99,21.27 10.86,19.11 5.79,16.48 4.95,40.51 10.36,28.35 18.85,42.7 8,32.82 9.58,30.62 8.14,31.69 13.34,34.92 13.34,36.2 14.61,36.2 15.88,36.2 15.88,34.92 15.88,33.66 14.61,33.66 13.34,33.66 5.52,37.64 13.54,27.71 10.16,50.93 8.89,50.93 7.62,50.93 6.35,50.93 5.08,50.93 3.81,50.93 11.43,50.93 12.7,50.93 14.73,50.93 16,50.93 17.27,50.93 18.54,50.93 19.81,50.93 21.08,50.93 22.35,50.93 23.62,50.93 24.89,50.93 26.16,50.93 27.43,50.93 13.08,49.91 15.49,49.91 14.1,47.88 16.64,47.88 16,48.77 14.35,46.61 16.51,46.61 14.35,45.34 16.51,45.34 16.51,44.07 16.51,42.8 14.99,41.53 18.92,20.64 16.64,23.43 20.83,23.56 13.08,46.61 13.08,45.34 13.08,47.88 11.43,49.66 10.16,49.66 8.89,49.66 16.76,49.91 17.27,48.77 17.91,47.88 17.78,46.61 17.78,45.34 17.78,44.07 18.54,49.66 19.81,49.66 21.08,49.66 22.35,49.66 23.62,49.66 19.68,34.29 21.34,23.94 21.29,31.14 24.13,35.43 24.77,35.43 25.4,35.43 26.04,35.43 24,20.64 23.37,20.64 22.73,20.64 24.64,20.64 25.27,20.64 25.91,20.64 26.54,20.64 24,19.37 23.37,19.37 22.73,19.37 24.64,19.37 25.27,19.37 25.91,19.37 26.54,19.37 5.28,16.48 5.28,18.01 5.79,18.01 6.3,18.01 6.81,18.01 6.3,16.48 6.81,16.48
  pour Top (isolate 0.203, rank 6): 0,59.69 0,0 27.94,0 27.94,59.69
  pour Bottom (isolate 0.203, rank 6): 27.94,59.69 27.94,0 0,0 0,59.69
I2C_SCL_1  (via drill 0.25)
  Top 0.178: U$1.22 10.28,33.52 10.03,33.27 10.03,32.26 9.91,32.13 9.02,32.13 8.64,31.75 8.64,30.48 8.38,30.23 6.86,30.23 6.35,29.72 6.35,26.92 v4.83,25.4 J2.4 | R12.1 4.95,12.7 5.21,12.95 v5.21,14.99
  Bottom 0.178: v4.83,25.4 4.83,22.99 5.08,22.73 5.08,19.05 4.7,18.67 4.7,15.88 5.21,15.37 v5.21,14.99
I2C_SCL_A  (via drill 0.25)
  Top 0.178: U$1.15 v9.78,36.33 v9.78,36.32 | R10.1 v4.45,41.91
  Bottom 0.178: v9.78,36.32 4.83,36.32 | 4.83,36.32 4.7,36.2 J1.4 | 4.83,36.32 4.83,39.24 5.71,40.13 5.71,41.66 5.46,41.91 v4.45,41.91
I2C_SDA_0
  Top 0.178: U$1.16 10.53,35.92 10.16,35.56 9.78,35.56
I2C_SDA_1  (via drill 0.25)
  Top 0.178: U$1.24 11.14,32.73 11.05,32.64 11.05,31.88 10.92,31.75 9.27,31.75 9.02,31.5 9.02,29.97 8.89,29.84 6.99,29.84 6.73,29.59 6.73,26.42 6.48,26.16 6.1,26.16 5.84,25.91 5.84,23.11 5.59,22.86 J2.3 | v4.57,13.97 R11.1
  Bottom 0.178: J2.3 4.32,22.86 4.57,22.61 4.57,19.18 4.32,18.92 4.32,15.75 4.57,15.49 v4.57,13.97
I2C_SDA_B
  Top 0.178: R9.1 4.19,40.64 4.32,40.51 4.32,36.96 4.57,36.7 4.57,33.78 4.45,33.66 J1.3
LNA_IN
  Top 0.178: L1.1 15.44,43.83 | U$1.2 16.41,39.2
  Top 0.762: L1.1 15.45,42.37 16.41,41.42 16.41,39.2 | 15.44,43.83 C8.1
N$1
  Top 0.178: R8.2 22.86,26.92 23.49,27.56 D4.C
N$2
  Top 0.178: D3.A R4.2
N$3  (via drill 0.25)
  Top 0.178: R4.1 14.82,6.57 v14.61,6.35
  Bottom 0.178: SJ2.1 v14.61,6.35
N$4  (via drill 0.25)
  Top 0.178: R11.2 v0.64,13.97
  Bottom 0.178: JP3.3 0.81,14.15 v0.64,13.97
N$5  (via drill 0.25)
  Top 0.178: R12.2 v0.64,12.7
  Bottom 0.178: JP3.1 0.81,12.52 v0.64,12.7
N$6  (via drill 0.25)
  Top 0.178: R9.2 v0.64,40.64
  Bottom 0.178: JP1.3 0.81,40.46 v0.64,40.64
N$7  (via drill 0.25)
  Top 0.178: U4.12 v9.65,23.18 | R13.2 v11.43,11.43
  Bottom 0.178: v9.65,23.18 9.65,13.21 v11.43,11.43
N$8  (via drill 0.25)
  Top 0.178: U4.11 v10.16,23.81 | R14.2 v12.7,11.43
  Bottom 0.178: v10.16,23.81 10.16,13.97 v12.7,11.43
N$9  (via drill 0.25)
  Top 0.178: U1.1 18.73,12.38 v18.14,12.98 | v18.8,8.38 18.8,2.3 D1.C
  Bottom 0.178: v18.14,12.98 18.8,12.32 v18.8,8.38
N$10
  Top 0.178: Q2.5 21.55,19.05 R17.2
N$11  (via drill 0.25)
  Top 0.178: R10.2 v0.64,41.91
  Bottom 0.178: JP1.1 0.81,42.09 v0.64,41.91
N$12
  Top 0.178: R18.2 17.31,19.9 17.53,19.68 17.53,19.3 17.78,19.05 Q2.2
N$14
  Top 0.178: R5.2 21.62,12.77 U1.5
  Bottom 0.178: SJ1.2 R5.2
N$16  (via drill 0.25)
  Top 0.178: R6.2 v21.8,15.88
  Bottom 0.178: SJ1.1 20.45,15.37 20.95,15.88 v21.8,15.88
N$17
  Top 0.178: D1.A R3.2
RES_14K
  Top 0.178: R2.2 18.8,37.59 18.67,37.47 18.67,36.96 18.44,36.73 U$1.47
RTS
  Top 0.178: U4.2 15.18,18.73 15.71,18.2 R18.1 17.36,18.2 17.65,17.91 19.05,17.91 19.18,18.03 19.18,18.16 19.42,18.4 Q2.4
SHIELD  (via drill 0.25)
  other vias: 10.16,1.97 6.48,1.97 13.84,1.97
  pour Top (isolate 0.305): 5.71,2.6 5.71,0 14.61,0 14.61,2.6
  pour Bottom (isolate 0.305): 14.61,2.6 14.61,0 5.71,0 5.71,2.6
TRACE_ANT
  Top 0.178: E1.ANT 13.72,51.1
  Top 0.762: 13.72,51.1 arc46 14.25,49.94 arc-35 L2.1 arc33 15.29,47.88 arc-37 15.42,47.57 15.42,47.23 C8.2
U0RXD  (via drill 0.25)
  Top 0.178: U4.20 v10.8,18.1 | v19.16,32.33 18.85,32.33 18.67,32.51 18.67,34.16 18.51,34.33 U$1.41
  Bottom 0.178: v10.8,18.1 13.27,20.57 15.18,20.57 15.68,20.07 20.07,20.07 22.61,22.61 22.61,27.81 22.48,27.94 22.48,32.13 22.28,32.33 v19.16,32.33
U0TXD  (via drill 0.25)
  Top 0.178: U4.4 14.67,20 v14.86,19.81 | U$1.42 18.74,34.73 19.18,34.29 v19.18,33.02 | v21.97,22.99 22.48,22.99 22.61,22.86 v22.61,21.84
  Bottom 0.178: v14.86,19.81 15.37,19.81 15.49,19.68 20.45,19.68 v22.61,21.84 | v19.18,33.02 18.8,33.02 18.67,32.89 18.67,32 18.92,31.75 21.72,31.75 21.97,31.5 21.97,27.94 22.22,27.69 22.22,23.24 v21.97,22.99
V_BATT  (via drill 0.25)
  Top 0.178: 20.59,8.26 C6.1 | U1.3 v20.32,10.48
  Top 0.457: JP2.2 20.59,8.26 v19.68,8.26 | Q1.3 16.98,14.45 v17.69,13.74
  Bottom 0.457: v19.68,8.26 19.68,9.85 v20.32,10.48 20.32,12.95 19.63,13.64 17.79,13.64 v17.69,13.74
V_USB  (via drill 0.25)
  Top 0.178: 23.49,10.48 C19.1 | U4.15 7.52,21.27 C14.1 C15.1
  Top 0.305: U4.15 9.72,21.27 11.81,19.18 11.81,17.78 12.57,17.02 15.11,17.02 15.81,16.32 v15.81,15.55
  Top 0.457: F1.2 8.38,10.93 9.53,12.06 D2.A 15.36,10.46 R7.2 v15.66,9.11 17.78,9.11 | Q1.1 v15.81,15.55 | 17.78,9.11 19.9,9.11 20.32,9.53 22.22,9.53 22.61,9.91 22.61,10.48 | 22.61,10.48 U1.4 | 22.61,10.48 23.49,10.48 | R3.1 17.78,9.11
  Bottom 0.457: v15.81,15.55 15.81,9.26 v15.66,9.11
VCC_FLASH  (via drill 0.25)
  Top 0.406: U5.8 16.46,28.65 15.96,28.16 C17.1 14.57,28.16 14.35,27.94 14.35,27.18 13.97,26.8 v13.97,26.04
  Bottom 0.406: SJ3.2 v13.97,26.04
VIN
  Top 0.178: 13.29,13.65 C7.1 | 14.82,13.71 Q1.2
  Top 0.457: U3.3 10.35,15.55 10.29,15.62 | 13.29,13.65 U3.1 10.6,13.65 10.29,13.97 10.29,15.62 | C7.1 14.82,13.71 | Q1.2 16.07,13.65 D2.C | 10.29,15.62 10.29,17.14 10.16,17.27 4.83,17.27 4.57,17.53 4.57,20.07 4.32,20.32 J2.2 1.91,20.32 1.52,20.7 1.52,30.86 1.78,31.11 J1.2
VUSB
  Top 0.178: 8.89,6.99 C11.1 8.86,7.38
  Top 0.406: JP15.VBUS 8.86,6.35
  Top 0.457: F1.1 6.99,6.6 7.24,6.35 8.86,6.35 8.86,7.38
XTAL_N_
  Top 0.178: U$1.44 18.07,35.52 18.41,35.18 22.86,35.18 23.11,34.92 23.11,32.77 22.87,32.53 Y1.3 22.04,32.55 C4.2
XTAL_P_
  Top 0.178: U$1.45 18.18,35.92 18.54,35.56 23.11,35.56 23.49,35.18 23.49,34.42 23.62,34.29 24.4,34.29 Y1.1 24.44,34.25 C3.2

### Text on the board
Bottom: v01
tPlace: Spectacle! | RST | 0 | Director / Board | CHL A | CHL B
bPlace: SJ3 | SJ1 | SJ2
tDocu: Jim Lindblom